# Altium project wulpus_pro_acq_pcb.PrjPcb (part 2 of 2)

## Sheet msp430.SchDoc: WULPUS PRO
size A3; DrawnBy: Sergei Vostrikov; Organization: Integrated Systems Laboratory; Revision: 1.0.0; SheetNumber: 6; SheetTotal: 8
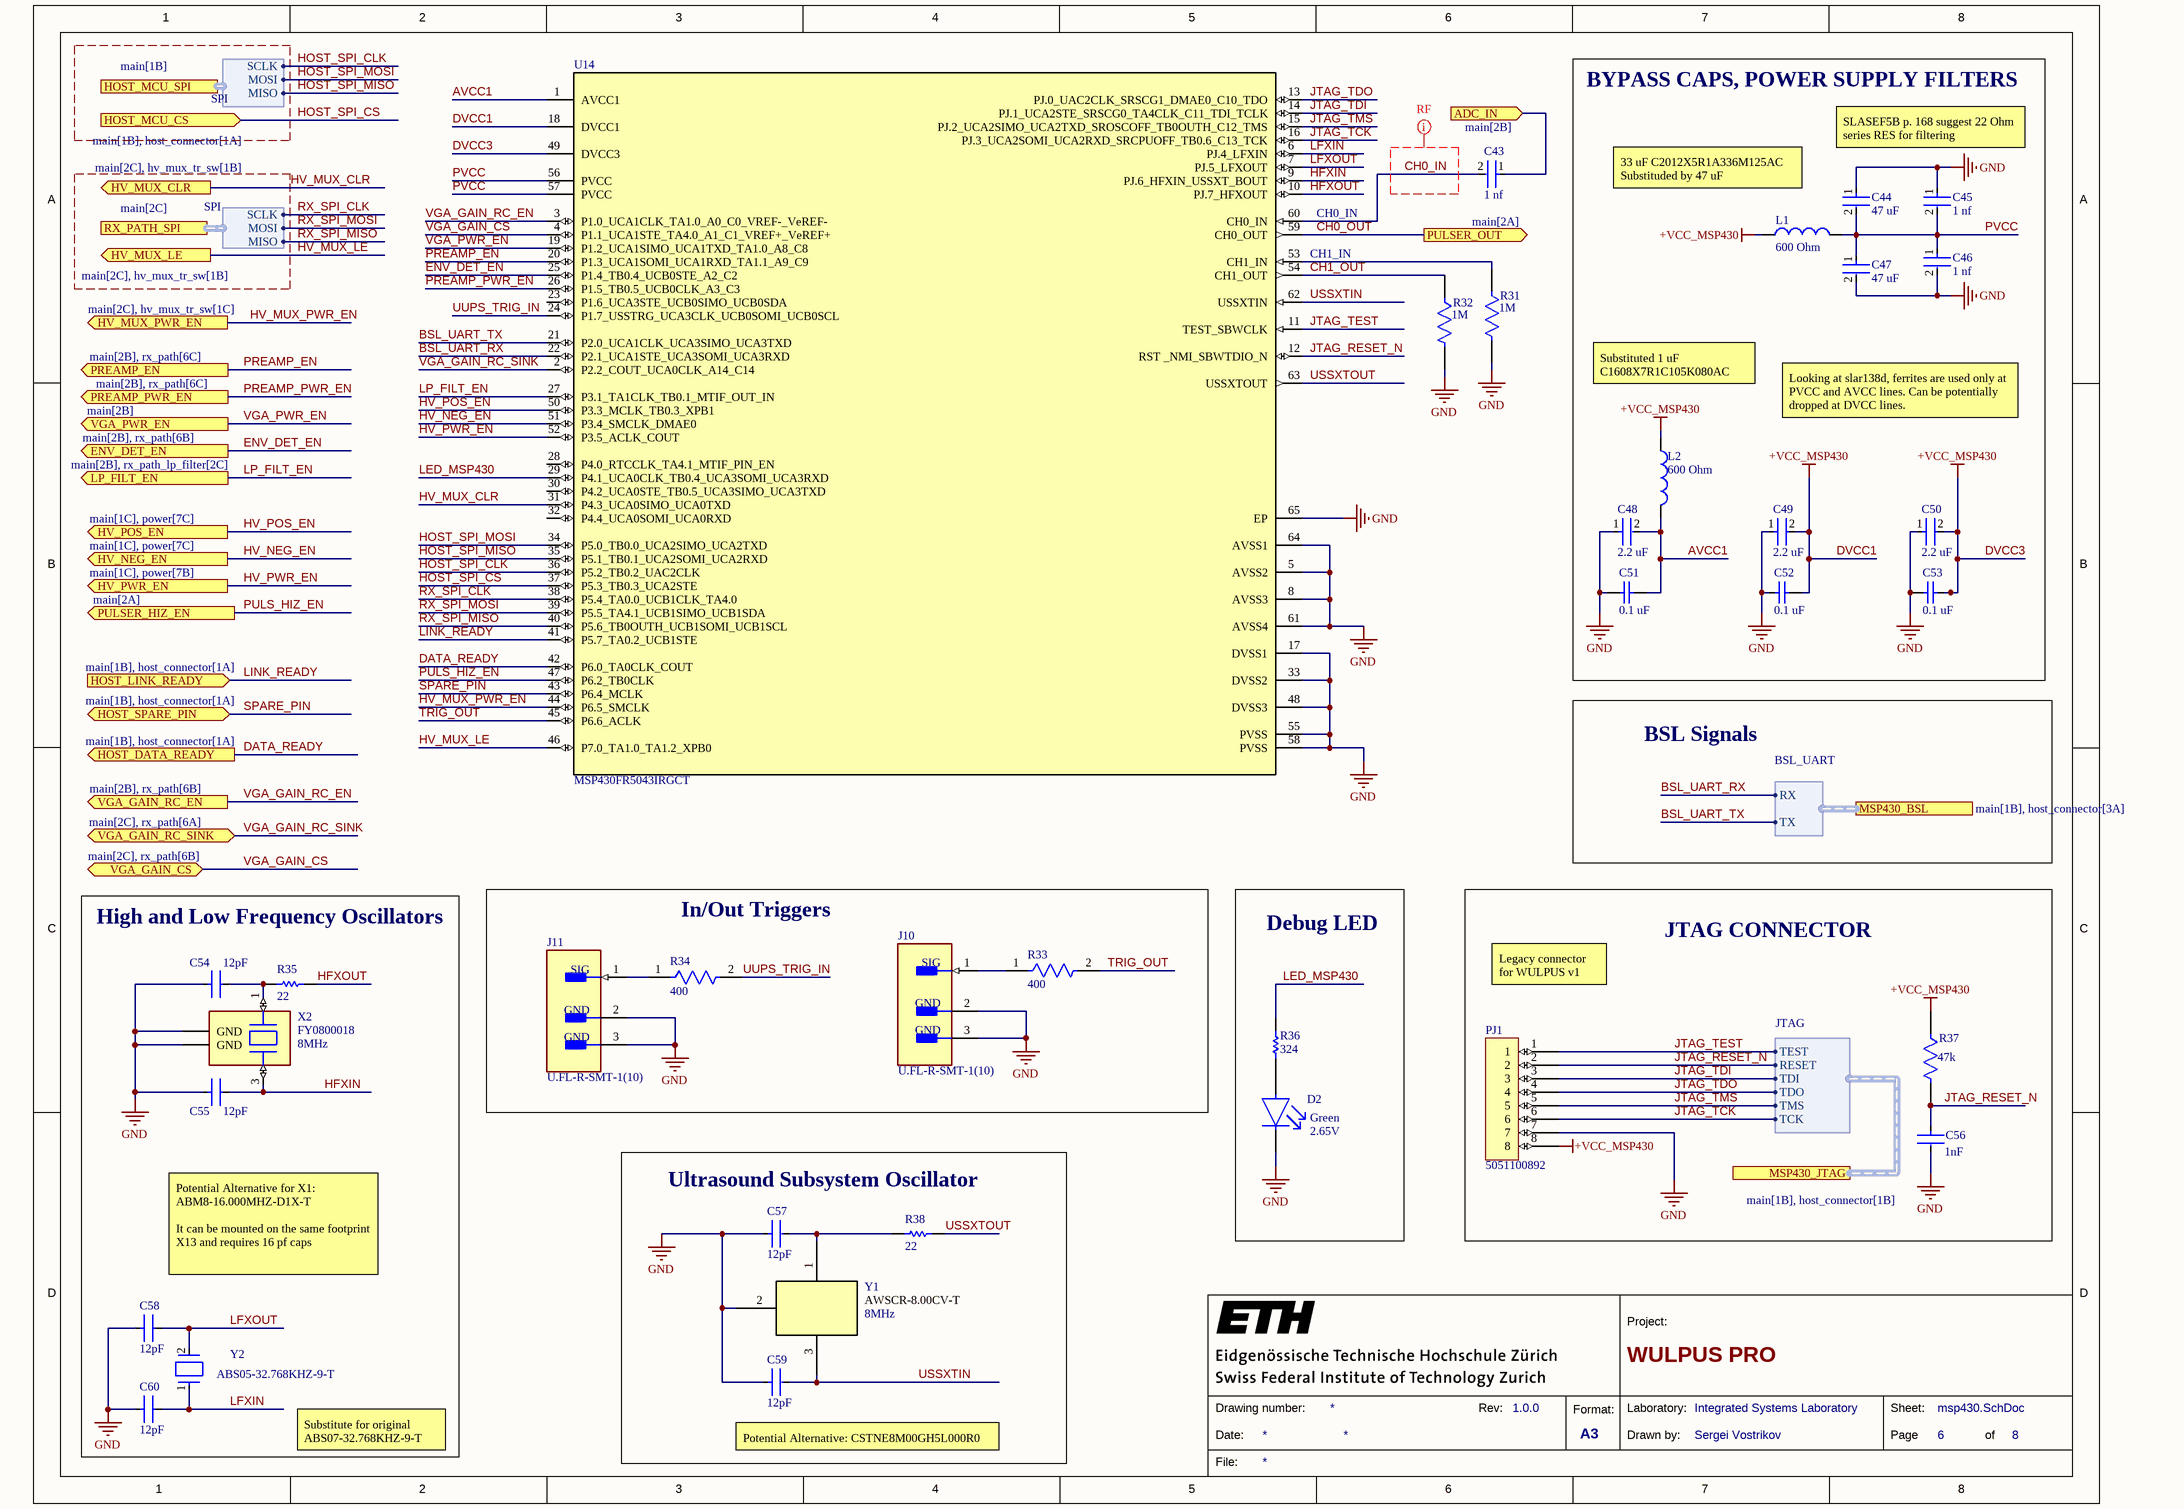
[diagram p5: msp430.SchDoc]

### Parts
C43  1 nf  [FP-GRM155-0_05-IPC_B]
C44  47 uF  [FP-GRM188-0_2-MFG]
C45  1 nf  [FP-GRM155-0_05-IPC_B]
C46  1 nf  [FP-GRM155-0_05-IPC_B]
C47  47 uF  [FP-GRM188-0_2-MFG]
C48  2.2 uF  [FP-C1005-050-0_15-0_1-MFG]
C49  2.2 uF  [FP-C1005-050-0_15-0_1-MFG]
C50  2.2 uF  [FP-C1005-050-0_15-0_1-MFG]
C51  0.1 uF  [CAPC1005X55X30LL05T10]
C52  0.1 uF  [CAPC1005X55X30LL05T10]
C53  0.1 uF  [CAPC1005X55X30LL05T10]
C54  Capacitance: 12pF  [FP-GJM155-0_05-IPC_A]  (hidden comment: GJM1555C1H120GB01D)
C55  Capacitance: 12pF  [FP-GJM155-0_05-IPC_A]  (hidden comment: GJM1555C1H120GB01D)
C56  Capacitance: 1nF  [FP-GRM155-0_05-IPC_B]  (hidden comment: GRM1555C1H102JA01D)
C57  Capacitance: 12pF  [FP-GJM155-0_05-IPC_A]  (hidden comment: GJM1555C1H120GB01D)
C58  Capacitance: 12pF  [FP-GJM155-0_05-IPC_A]  (hidden comment: GJM1555C1H120GB01D)
C59  Capacitance: 12pF  [FP-GJM155-0_05-IPC_A]  (hidden comment: GJM1555C1H120GB01D)
C60  Capacitance: 12pF  [FP-GJM155-0_05-IPC_A]  (hidden comment: GJM1555C1H120GB01D)
D2  Forward Voltage: 2.65V  Color: Green  [FP-APHD1608LZGCK-MFG]  (hidden comment: APHD1608LZGCK)
J10  U.FL-R-SMT-1(10)  [FP-U_FL-R-SMT-1_10-MFG]
J11  U.FL-R-SMT-1(10)  [FP-U_FL-R-SMT-1_10-MFG]
L1  Impedance: 600 Ohm  [SMD-0805]  (hidden comment: 742792040)
L2  Impedance: 600 Ohm  [SMD-0805]  (hidden comment: 742792040)
PJ1  5051100892  [MOLEX_5051100892]
R31  Resistance: 1M  [FP-CRCW0402-e3-MFG]  (hidden comment: CRCW04021M00FKED)
R32  Resistance: 1M  [FP-CRCW0402-e3-MFG]  (hidden comment: CRCW04021M00FKED)
R33  400  [FP-CRCW0402-C-e3-MFG]
R34  400  [FP-CRCW0402-C-e3-MFG]
R35  Resistance: 22  [RESC1005X40X25NL05T10]  (hidden comment: RC0402JR-0722RL)
R36  Resistance: 324  [RESC1005X35X20ML05T10]  (hidden comment: CPF0402B324RE1)
R37  Resistance: 47k  [FP-CRCW0402-e3-IPC_C]  (hidden comment: CRCW040247K0FKED)
R38  Resistance: 22  [RESC1005X40X25NL05T10]  (hidden comment: RC0402JR-0722RL)
U14  MSP430FR5043IRGCT  [RGC0064G]
X2  FY0800018  Frequency: 8MHz  [XTAL_ECS-80-18-30B-AGN-TR]
Y1  Frequency: 8MHz  [AWSCR-8.00CV-T_ABR]  (hidden comment: AWSCR-8.00CV-T)
Y2  ABS05-32.768KHZ-9-T  [FP-ABS05-MFG]

### Blocks framed on the sheet
BYPASS CAPS, POWER SUPPLY FILTERS: C44-C53 L1 L2
High and Low Frequency Oscillators: C54 C55 C58 C60 R35 X2 Y2
In/Out Triggers: J10 J11 R33 R34
Debug LED: D2 R36
JTAG CONNECTOR: C56 PJ1 R37
Ultrasound Subsystem Oscillator: C57 C59 R38 Y1

### Ports
ADC_IN (in, see main[2B]), ENV_DET_EN (out, see main[2B], rx_path[6B]), HOST_DATA_READY (out, see main[1B], host_connector[1A]), HOST_LINK_READY (in, see main[1B], host_connector[1A]), HOST_MCU_CS (in, see main[1B], host_connector[1A]), HOST_MCU_SPI (harness SPI, see main[1B]), HOST_SPARE_PIN (bidir, see main[1B], host_connector[1A]), HV_MUX_CLR (out, see main[2C], hv_mux_tr_sw[1B]), HV_MUX_LE (out, see main[2C], hv_mux_tr_sw[1B]), HV_MUX_PWR_EN (out, see main[2C], hv_mux_tr_sw[1C]), HV_NEG_EN (out, see main[1C], power[7C]), HV_POS_EN (out, see main[1C], power[7C]), HV_PWR_EN (out, see main[1C], power[7B]), LP_FILT_EN (out, see main[2B], rx_path_lp_filter[2C]), MSP430_BSL (harness BSL_UART, see main[1B], host_connector[3A]), MSP430_JTAG (harness JTAG, see main[1B], host_connector[1B]), PREAMP_EN (out, see main[2B], rx_path[6C]), PREAMP_PWR_EN (out, see main[2B], rx_path[6C]), PULSER_HIZ_EN (out, see main[2A]), PULSER_OUT (out, see main[2A]), RX_PATH_SPI (harness SPI, see main[2C]), VGA_GAIN_CS (bidir, see main[2C], rx_path[6B]), VGA_GAIN_RC_EN (out, see main[2B], rx_path[6B]), VGA_GAIN_RC_SINK (bidir, see main[2C], rx_path[6A]), VGA_PWR_EN (out, see main[2B])

### Harnesses
SPI: SCLK, MOSI, MISO
JTAG: TEST, RESET, TDI, TDO, TMS, TCK
BSL_UART: TX, RX

### Nets
DVCC1: C49.2 C50.2 C52.1 C53.1 L1.1 L2.1 PJ1.8 R37.1 U14.18(DVCC1) U14.49(DVCC3)  [also labelled +VCC_MSP430, DVCC3]
GND: C44.1 C45.1 C46.2 C47.2 C48.1 C49.1 C50.1 C51.2 C52.2 C53.2 C54.1 C55.1 C56.2 C57.1 C58.1 C59.1 C60.1 D2.1(C) J10.2(GND) J10.3(GND) J11.2(GND) J11.3(GND) PJ1.7 R31.2 R32.2 U14.5(AVSS2) U14.8(AVSS3) U14.17(DVSS1) U14.33(DVSS2) U14.48(DVSS3) U14.55(PVSS) U14.58(PVSS) U14.61(AVSS4) U14.64(AVSS1) U14.65(EP) X2.2(GND) X2.4(GND) Y1.2
AVCC1: C48.2 C51.1 L2.2 U14.1(AVCC1)
BSL_UART_RX: U14.22(P2.1_UCA1STE_UCA3SOMI_UCA3RXD) ; port MSP430_BSL.RX
BSL_UART_TX: U14.21(P2.0_UCA1CLK_UCA3SIMO_UCA3TXD) ; port MSP430_BSL.TX
CH0_IN: C43.2 U14.60(CH0_IN)
CH0_OUT: U14.59(CH0_OUT) ; port PULSER_OUT
CH1_OUT: R32.1 U14.54(CH1_OUT)
DATA_READY: U14.42(P6.0_TA0CLK_COUT) ; port HOST_DATA_READY
ENV_DET_EN: U14.25(P1.4_TB0.4_UCB0STE_A2_C2) ; port ENV_DET_EN
HFXIN: C55.2 U14.9(PJ.6_HFXIN_USSXT_BOUT) X2.3(OUT/IN)
HFXOUT: R35.2 U14.10(PJ.7_HFXOUT)
HOST_SPI_CLK: U14.36(P5.2_TB0.2_UAC2CLK) ; port HOST_MCU_SPI.SCLK
HOST_SPI_CS: U14.37(P5.3_TB0.3_UCA2STE) ; port HOST_MCU_CS
HOST_SPI_MISO: U14.35(P5.1_TB0.1_UCA2SOMI_UCA2RXD) ; port HOST_MCU_SPI.MISO
HOST_SPI_MOSI: U14.34(P5.0_TB0.0_UCA2SIMO_UCA2TXD) ; port HOST_MCU_SPI.MOSI
HV_MUX_CLR: U14.31(P4.3_UCA0SIMO_UCA0TXD) ; port HV_MUX_CLR
HV_MUX_LE: U14.46(P7.0_TA1.0_TA1.2_XPB0) ; port HV_MUX_LE
HV_MUX_PWR_EN: U14.44(P6.5_SMCLK) ; port HV_MUX_PWR_EN
HV_NEG_EN: U14.51(P3.4_SMCLK_DMAE0) ; port HV_NEG_EN  [project net HV_EN2]
HV_POS_EN: U14.50(P3.3_MCLK_TB0.3_XPB1) ; port HV_POS_EN  [project net HV_EN1]
HV_PWR_EN: U14.52(P3.5_ACLK_COUT) ; port HV_PWR_EN
JTAG_RESET_N: C56.1 PJ1.2 R37.2 U14.12(RST__NMI_SBWTDIO_N) ; port MSP430_JTAG.RESET
JTAG_TCK: PJ1.6 U14.16(PJ.3_UCA2SOMI_UCA2RXD_SRCPUOFF_TB0.6_C13_TCK) ; port MSP430_JTAG.TCK
JTAG_TDI: PJ1.3 U14.14(PJ.1_UCA2STE_SRSCG0_TA4CLK_C11_TDI_TCLK) ; port MSP430_JTAG.TDI
JTAG_TDO: PJ1.4 U14.13(PJ.0_UAC2CLK_SRSCG1_DMAE0_C10_TDO) ; port MSP430_JTAG.TDO
JTAG_TEST: PJ1.1 U14.11(TEST_SBWCLK) ; port MSP430_JTAG.TEST
JTAG_TMS: PJ1.5 U14.15(PJ.2_UCA2SIMO_UCA2TXD_SROSCOFF_TB0OUTH_C12_TMS) ; port MSP430_JTAG.TMS
LED_MSP430: R36.1 U14.29(P4.1_UCA0CLK_TB0.4_UCA3SOMI_UCA3RXD)
LFXIN: C60.2 U14.6(PJ.4_LFXIN) Y2.1
LFXOUT: C58.2 U14.7(PJ.5_LFXOUT) Y2.2
LINK_READY: U14.41(P5.7_TA0.2_UCB1STE) ; port HOST_LINK_READY  [project net HOST_LINK_RDY]
LP_FILT_EN: U14.27(P3.1_TA1CLK_TB0.1_MTIF_OUT_IN) ; port LP_FILT_EN  [project net FILTER_SHDN_N]
PREAMP_EN: U14.20(P1.3_UCA1SOMI_UCA1RXD_TA1.1_A9_C9) ; port PREAMP_EN
PREAMP_PWR_EN: U14.26(P1.5_TB0.5_UCB0CLK_A3_C3) ; port PREAMP_PWR_EN
PULS_HIZ_EN: U14.47(P6.2_TB0CLK) ; port PULSER_HIZ_EN
PVCC: C44.2 C45.2 C46.1 C47.1 L1.2 U14.56(PVCC) U14.57(PVCC)
RX_SPI_CLK: U14.38(P5.4_TA0.0_UCB1CLK_TA4.0) ; port RX_PATH_SPI.SCLK
RX_SPI_MISO: U14.40(P5.6_TB0OUTH_UCB1SOMI_UCB1SCL) ; port RX_PATH_SPI.MISO
RX_SPI_MOSI: U14.39(P5.5_TA4.1_UCB1SIMO_UCB1SDA) ; port RX_PATH_SPI.MOSI
SPARE_PIN: U14.43(P6.4_MCLK) ; port HOST_SPARE_PIN  [project net HOST_SPARE]
TRIG_OUT: R33.2 U14.45(P6.6_ACLK)
USSXTIN: C59.2 U14.62(USSXTIN) Y1.3
USSXTOUT: R38.2 U14.63(USSXTOUT)
UUPS_TRIG_IN: R34.2 U14.24(P1.7_USSTRG_UCA3CLK_UCB0SOMI_UCB0SCL)
VGA_GAIN_CS: U14.4(P1.1_UCA1STE_TA4.0_A1_C1_VREF+_VeREF+) ; port VGA_GAIN_CS
VGA_GAIN_RC_EN: U14.3(P1.0_UCA1CLK_TA1.0_A0_C0_VREF-_VeREF-) ; port VGA_GAIN_RC_EN
VGA_GAIN_RC_SINK: U14.2(P2.2_COUT_UCA0CLK_A14_C14) ; port VGA_GAIN_RC_SINK
VGA_PWR_EN: U14.19(P1.2_UCA1SIMO_UCA1TXD_TA1.0_A8_C8) ; port VGA_PWR_EN
NetC27_2: C43.1 ; port ADC_IN
NetC54_2: C54.2 R35.1 X2.1(IN/OUT)
NetC57_2: C57.2 R38.1 Y1.1
NetD2_2: D2.2(A) R36.2
NetJ10_1: J10.1(SIG) R33.1
NetJ11_1: J11.1(SIG) R34.1
NetR31_1: R31.1 U14.53(CH1_IN)

Not connected (* = marked no-connect by the designer): U14 23(P1.6_UCA3STE_UCB0SIMO_UCB0SDA) 28(P4.0_RTCCLK_TA4.1_MTIF_PIN_EN) 30(P4.2_UCA0STE_TB0.5_UCA3SIMO_UCA3TXD) 32(P4.4_UCA0SOMI_UCA0RXD)

### Layout directives
net class RF: CH0_IN

### Notes on the sheet
- 33 uF C2012X5R1A336M125AC Substituded by 47 uF
- SLASEF5B p. 168 suggest 22 Ohm series RES for filtering
- (near U14) CH0_IN
- (near U14) CH1_IN
- Substituted 1 uF C1608X7R1C105K080AC
- Looking at slar138d, ferrites are used only at PVCC and AVCC lines. Can be potentially dropped at DVCC lines.
- BSL Signals
- Legacy connector for WULPUS v1
- Potential Alternative for X1:
  ABM8-16.000MHZ-D1X-T
  It can be mounted on the same footprint X13 and requires 16 pf caps
- Substitute for original ABS07-32.768KHZ-9-T
- (near C59) Potential Alternative: CSTNE8M00GH5L000R0
- 1
- 2
- 3
- 4
- 5
- 6
- 7
- 8
- A
- B
- C
- D
- Project:
- Date:
- Drawing number:
- Rev:
- Format:
- A3
- Drawn by:
- Laboratory:
- Page
- Sheet:
- of
- File:

### Library data of the parts
C43 C45 C46 = CMP-2008-04254-2: GRM1555C1H102JA01D; Tolerance: 5%; Temperature Coefficient: 30ppm/°C; Insulation Resistance: 10GR; Material: Ceramic; Voltage Rating: 50V; Dielectric: C0G; Capacitance: 1nF; Packaging: Tape and Reel; Lead Free: Lead Free; Thickness: 0.022inch; Termination: SMD/SMT; Max Operating Temperature: 125°C; Height: 0.5mm; Package Quantity: 1; Radiation Hardening: No; Case Code (Metric): 1005; Number of Pins: 2; Mount: Surface Mount; Voltage: 50V; Case/Package: 0402; Min Operating Temperature: -55°C; Dielectric Material: Ceramic; Width: 0.5mm; Depth: 0.5mm; Case Code (Imperial): 0402; REACH SVHC: No SVHC; Voltage Rating (DC): 50V; Length: 1mm
C44 C47 = CMP-00260-117335223-1: GRM188R60J476ME01D; Material: Ceramic; Tolerance: 20%; Voltage Rating (DC): 6.3V; Dielectric: X5R; Capacitance: 47µF; Case/Package: 0603; Width: 800µm; Min Operating Temperature: -55°C; Lifecycle Status: Production; Height: 1mm; Length: 1.6mm; Max Operating Temperature: 85°C; Voltage Rating: 6.3V; NexarPartId: 117335223; Thickness: 800µm
C48-C50 = CMP-08246-004344-1: C1005X7S1A225K050BC; Capacitance: 2.2uF; Dielectric: X7S; Dielectric Material: Ceramic; Voltage Rating: 10V; Tolerance: 10%; Mount: Surface Mount; Height: 0.5mm; Package Quantity: 1; Depth: 0.5mm; RoHS Compliant: Yes; Length: 1mm; Thickness: 0.022inch; Packaging: Tape and Reel; Case Code (Imperial): 0402; Resistor Type: Ceramic; Case/Package: 0402; Min Operating Temperature: -55°C; Series: C; Weight: 2.3E-05oz; Width: 0.02inch; Voltage Rating (DC): 10V; Case Code (Metric): 1005; Max Operating Temperature: 125°C; Termination: SMD/SMT; Lead Free: Lead Free
C51-C53 = CMP-0001-00074-2: C0402C104K4RACTU; Manufacturer: Kemet; Part Number: C0402C104K4RACTU
C54 C55 C57-C60 = CMP-2008-03799-2: Multi-Layer Ceramic Capacitor 12pF C0G  ±2% 0402 Paper T/R; Voltage Rating: 50V; Tolerance: 2%; Length: 1mm; Width: 0.5mm; Thickness: 0.022inch; Package Quantity: 10000; Lead Free: Lead Free; Mount: Surface Mount; Voltage Rating (DC): 50V; Max Operating Temperature: 125°C; Termination: SMD/SMT; Depth: 0.5mm; Min Operating Temperature: -55°C; Height: 0.5mm; Case Code (Imperial): 0402; Case/Package: 0402; Case Code (Metric): 1005; Dielectric: C0G; Packaging: Tape and Reel; Radiation Hardening: No
C56 = CMP-2008-04254-2: Chip Multilayer Ceramic Capacitors for General Purpose, 0402, 1000pF, C0G, 30ppm/°C, 5%, 50V; Insulation Resistance: 10GR; Packaging: Tape and Reel; Lead Free: Lead Free; Tolerance: 5%; Temperature Coefficient: 30ppm/°C; Thickness: 0.022inch; Termination: SMD/SMT; Max Operating Temperature: 125°C; Height: 0.5mm; Package Quantity: 1; Radiation Hardening: No; Material: Ceramic; Case Code (Metric): 1005; Number of Pins: 2; Voltage Rating: 50V; Mount: Surface Mount; Voltage: 50V; Case/Package: 0402; Min Operating Temperature: -55°C; Dielectric Material: Ceramic; Width: 0.5mm; Depth: 0.5mm; Case Code (Imperial): 0402; REACH SVHC: No SVHC; Dielectric: C0G; Voltage Rating (DC): 50V; Length: 1mm
D2 = CMP-44529-000045-1: LED GREEN CLEAR 1608 SMD; Test Current: 2mA; Dominant Wavelength: 525nm; Lens Color: Colorless; Luminous Intensity: 180mcd; Viewing Angle: 100°; Lens Size: 0.7mm; Lens Style: Round; Mount: Surface Mount; Packaging: Tape and Reel; Lens Transparency: Clear; Height: 0.75mm; Case/Package: 0603; Length: 1.6mm; Case Code (Metric): 1608; Width: 0.8mm; Case Code (Imperial): 0603
J10 J11 = CMP-2000-05152-3: CONN U.FL RCPT STR 50 OHM SMD; Max Frequency: 6GHz; Connector Type: Coaxial; Body Plating: Silver; Body Material: Bronze; Impedance: 50R; Dielectric Material: Polymer; Insulation Resistance: 500MR; Gender: Male; Packaging: Cut Tape; Length: 3mm; Package Quantity: 2500; Termination: Solder; Lead Free: Lead Free; Series: U.FL; Min Operating Temperature: -40°C; Fastening Type: Snap; Contact Material: Brass; Orientation: Straight; Wire/Cable Type: Coaxial; Frequency: 6GHz; Contact Plating: Gold; Depth: 3.1mm; Weight: 0.001764oz; Max Operating Temperature: 90°C; Radiation Hardening: No; REACH SVHC: No SVHC; Mount: Surface Mount; Housing Color: Beige
L1 L2 = CMP-0220-00032-1: SMD EMI Suppression Ferrite Bead WE-CBF, Z = 600 Ohm; PackageVersion: 2005; ComponentLink2Description: Datasheet; PackageDescription: Chip Inductor, 2-Leads, Body 2.0 x 1.2 mm; ComponentLink1URL: http://www.we-online.com; PackageReference: SMD-0805; DatasheetVersion: Dec-2005; ComponentLink2URL: http://www.we-online.de/katalog/media/pdf/742792040.pdf; ComponentLink1Description: Manufacturer Link
PJ1 = MOLEX_5051100892
R31 R32 = CMP-2002-08314-2: RES Thick Film, 1MΩ, 1%, 0.063W, 100ppm/°C, 0402; Power Rating: 63mW; Voltage Rating (DC): 50V; Min Operating Temperature: -55°C; Lead Free: Lead Free; Case Code (Imperial): 0402; Packaging: Tape and Reel; Case Code (Metric): 1005; Tolerance: 1%; Number of Terminations: 2; Features: Automotive AEC-Q200; Number of Pins: 2; Max Power Dissipation: 63mW; Height: 0.35mm; Weight: 2.3E-05oz; Package Quantity: 10; Contact Plating: Tin; Temperature Coefficient: 100ppm/°C; Radiation Hardening: No; Length: 1mm; Termination: SMD/SMT; Depth: 0.5mm; Case/Package: 0402; Voltage Rating: 50V; Composition: Thick Film; Width: 0.02inch; Max Operating Temperature: 155°C; Military Standard: Not
R33 R34 = CMP-00030-23798141-1: CRCW04021R00FKEDC; Resistance: 1Ω; Tolerance: 1%; Temperature Coefficient: 100ppm/°C; Voltage Rating: 50V; Power Rating: 63mW; Lead Free: Lead Free; Case/Package: 0402; Max Operating Temperature: 155°C; RoHS: Compliant; Height: 350µm; Schedule B: 8533210045, 8533210045; Composition: Thick Film; NexarPartId: 23798141; Min Operating Temperature: -55°C
R35 R38 = CMP-2002-07961-1: Manufacturer: Yageo / Phycomp; Part Number: RC0402JR-0722RL
R36 = CMP-2002-03257-1: Manufacturer: TE Connectivity / AMP; Part Number: CPF0402B324RE1
R37 = CMP-02407-007705-1: RES Thick Film, 47kΩ, 1%, 0.063W, 100ppm/°C, 0402; Voltage Rating (DC): 50V; Power Rating: 63mW; Temperature Coefficient: 100ppm/°C; Mount: Surface Mount; Radiation Hardening: No; Case Code (Imperial): 0402; Case Code (Metric): 1005; Contact Plating: Tin; Case/Package: 0402; Package Quantity: 10000; Width: 0.5mm; Lead Free: Lead Free; Packaging: Tape and Reel; Length: 1mm; Max Operating Temperature: 155°C; Min Operating Temperature: -55°C; Tolerance: 1%; Weight: 2.3E-05oz; Working Voltage: 50V; Voltage Rating: 50V; Height: 0.35mm; Depth: 0.5mm; Composition: Thick Film; Number of Terminations: 2; Termination: SMD/SMT; Military Standard: Not
U14 = MSP430FR5043IRGCT: No Description Available; Mfr_Name: Texas Instruments; Type: DEV; RefDes: RefDes; Copyright: Copyright (C) 2021 Ultra Librarian. All rights reserved.; Manufacturer_Part_Number: MSP430FR5043IRGCT
X2 = FY0800018: Crystal 8MHz ±30ppm (Tol) ±30ppm (Stability) 18pF FUND 100Ohm 4-Pin SMD T/R; Manufacturer: Diodes; ESR (Equivalent Series Resistance): 100R; Supplier 1: Digi-Key; Manufacturer Part Number: FY0800018; RoHS: Yes; Category: Crystals; Stock 1: 10869; Pricing 1: 1=0.80000, 10=0.70800, 50=0.66220, 100=0.58520, 500=0.55440 (USD); Mount: Surface Mount; Case/Package: SMD/SMT; Min Operating Temperature: -40°C; Max Operating Temperature: 85°C; Packaging: Cut Tape; Frequency Stability: 30ppm; Frequency Tolerance: 30ppm; Load Capacitance: 18pF; Length: 0.197inch; Width: 0.126inch; Height: 0.043inch; ComponentLink1URL: http://media.digikey.com/pdf/Data%20Sheets/Pericom%20PDFs/FY0800018_VerB.pdf?src-supplier=Digi-Key; ComponentLink1Description: http://media.digikey.com/pdf/Data%20Sheets/Pericom%20PDFs/FY0800018_VerB.pdf?src-supplier=Digi-Key; Supplier Part Number 1: FY0800018CT-ND
Y1 = AWSCR-8.00CV-T: No Description Available; Mfr_Name: Abracon; Copyright: Copyright (C) 2021 Ultra Librarian. All rights reserved.; RefDes: RefDes; Type: DEV; Manufacturer_Part_Number: AWSCR-8.00CV-T
Y2 = CMP-27762-000002-3: CRYSTAL 32.7680KHZ 9PF SMD; Tolerance: 20ppm; Series Resistance: 90kR; Series: ABS05; Frequency: 32.768kHz; Radiation Hardening: No; Min Operating Temperature: -40°C; RoHS Compliant: Yes; Termination: SMD/SMT; Max Operating Temperature: 85°C; Depth: 1mm; Load Capacitance: 9pF; Number of Pins: 2; Frequency Tolerance: 20ppm; Package Quantity: 3000; Operating Frequency: 32.768 kHz; Case/Package: CSMD; Height: 0.5mm; Length: 1.6mm; REACH SVHC: No SVHC; Packaging: Tape and Reel; ESR (Equivalent Series Resistance): 90kR; Mount: Surface Mount; Lead Free: Lead Free; Width: 1mm

## Sheet host_connector.SchDoc: WULPUS PRO
size A4; DrawnBy: Sergei Vostrikov; Organization: Integrated Systems Laboratory; Revision: 1.0.0; SheetNumber: 8; SheetTotal: 8
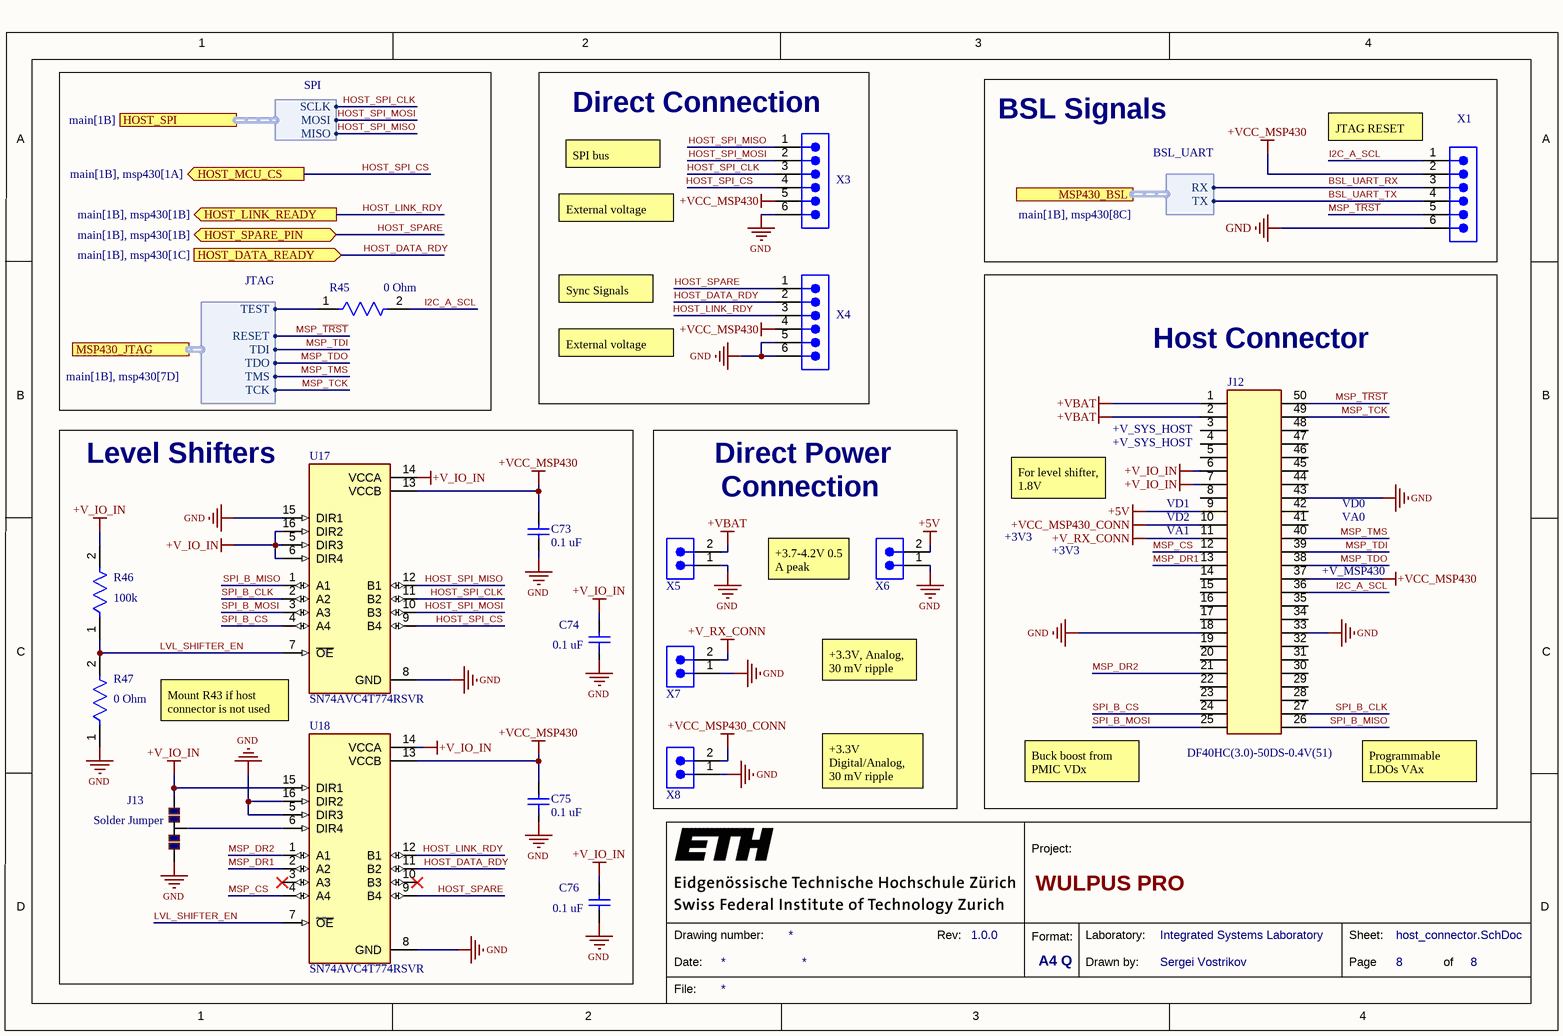
[diagram p6: host_connector.SchDoc]

### Parts
C73  0.1 uF  [CAPC1005X55X30LL05T10]
C74  0.1 uF  [CAPC1005X55X30LL05T10]
C75  0.1 uF  [CAPC1005X55X30LL05T10]
C76  0.1 uF  [CAPC1005X55X30LL05T10]
J12  DF40HC(3.0)-50DS-0.4V(51)  [DF40HC3050DS04V51]
J13  Solder Jumper  [Jumper 3 pins]  (no BOM)
R45  0 Ohm  [FP-CRCW0402-e3-IPC_C]
R46  100k  [FP-ERJ2RK-IPC_C]
R47  0 Ohm  [FP-CRCW0402-e3-IPC_C]
U17  SN74AVC4T774RSVR  [QFN40P260X180X55-16N]
U18  SN74AVC4T774RSVR  [QFN40P260X180X55-16N]
X1  68000-106HLF  [68000-106HLF]  (value not drawn)
X3  68000-106HLF  [68000-106HLF]  (value not drawn)
X4  68000-106HLF  [68000-106HLF]  (value not drawn)
X5  68000-102HLF  [68000-102HLF]  (value not drawn)
X6  68000-102HLF  [68000-102HLF]  (value not drawn)
X7  68000-102HLF  [68000-102HLF]  (value not drawn)
X8  68000-102HLF  [68000-102HLF]  (value not drawn)

### Blocks framed on the sheet
Direct Connection: X3 X4
BSL Signals: X1
Host Connector: J12
Level Shifters: C73-C76 J13 R46 R47 U17 U18

### Ports
HOST_DATA_READY (in, see main[1B], msp430[1C]), HOST_LINK_READY (out, see main[1B], msp430[1B]), HOST_MCU_CS (out, see main[1B], msp430[1A]), HOST_SPARE_PIN (bidir, see main[1B], msp430[1B]), HOST_SPI (harness SPI, see main[1B]), MSP430_BSL (harness BSL_UART, see main[1B], msp430[8C]), MSP430_JTAG (harness JTAG, see main[1B], msp430[7D])

### Harnesses
SPI: SCLK, MOSI, MISO
JTAG: TEST, RESET, TDI, TDO, TMS, TCK
BSL_UART: TX, RX

### Nets
+5V: J12.9 X6.2
+V_IO_IN: C74.1 C76.1 J12.6 J12.7 J13.3 R46.2 U17.5(DIR3) U17.6(DIR4) U17.14(VCCA) U17.16(DIR2) U18.14(VCCA) U18.15(DIR1)
+V_RX_CONN: J12.11 X7.2
+VBAT: J12.1 J12.2 X5.2
+VCC_MSP430: C73.1 C75.1 J12.37 U17.13(VCCB) U18.13(VCCB) X1.2 X3.5 X4.4  [project net DVCC1]
+VCC_MSP430_CONN: J12.10 X8.2
GND: C73.2 C74.2 C75.2 C76.2 J12.18 J12.33 J12.43 J13.1 R47.1 U17.8(GND) U17.15(DIR1) U18.5(DIR3) U18.8(GND) U18.16(DIR2) X1.6 X3.6 X4.5 X4.6 X5.1 X6.1 X7.1 X8.1
BSL_UART_RX: X1.3 ; port MSP430_BSL.RX
BSL_UART_TX: X1.4 ; port MSP430_BSL.TX
HOST_DATA_RDY: U18.11(B2) X4.2 ; port HOST_DATA_READY  [project net DATA_READY]
HOST_LINK_RDY: U18.12(B1) X4.3 ; port HOST_LINK_READY
HOST_SPARE: U18.9(B4) X4.1 ; port HOST_SPARE_PIN
HOST_SPI_CLK: U17.11(B2) X3.3 ; port HOST_SPI.SCLK
HOST_SPI_CS: U17.9(B4) X3.4 ; port HOST_MCU_CS
HOST_SPI_MISO: U17.12(B1) X3.1 ; port HOST_SPI.MISO
HOST_SPI_MOSI: U17.10(B3) X3.2 ; port HOST_SPI.MOSI
I2C_A_SCL: J12.36 R45.2 X1.1
JTAG_TEST: R45.1 ; port MSP430_JTAG.TEST
LVL_SHIFTER_EN: R46.1 R47.2 U17.7(~{OE}) U18.7(~{OE})
MSP_CS: J12.12 U18.4(A4)
MSP_DR1: J12.13 U18.2(A2)
MSP_DR2: J12.21 U18.1(A1)
MSP_~{TRST}: J12.50 X1.5 ; port MSP430_JTAG.RESET  [project net JTAG_RESET_N]
MSP_TCK: J12.49 ; port MSP430_JTAG.TCK  [project net JTAG_TCK]
MSP_TDI: J12.39 ; port MSP430_JTAG.TDI  [project net JTAG_TDI]
MSP_TDO: J12.38 ; port MSP430_JTAG.TDO  [project net JTAG_TDO]
MSP_TMS: J12.40 ; port MSP430_JTAG.TMS  [project net JTAG_TMS]
SPI_B_CLK: J12.27 U17.2(A2)
SPI_B_CS: J12.24 U17.4(A4)
SPI_B_MISO: J12.26 U17.1(A1)
SPI_B_MOSI: J12.25 U17.3(A3)
NetJ13_2: J13.2 U18.6(DIR4)

Not connected (* = marked no-connect by the designer): J12 3 4 5 8 14 15 16 17 19 20 22 23 28 29 30 31 32 34 35 41 42 44 45 46 47 48; U18 3(A3)* 10(B3)*

### Notes on the sheet
- SPI bus
- (near X1) JTAG RESET
- External voltage level
- Sync Signals
- (near J12) +V_SYS_HOST
- Direct Power
- Connection
- For level shifter, 1.8V
- (near J12) VD1
- (near J12) VD2
- VD0
- VA0
- +3.7-4.2V 0.5 A peak
- +3V3
- (near J12) VA1
- (near J12) +V_MSP430
- Mount R43 if host connector is not used
- +3.3V, Analog, 30 mV ripple
- +3.3V Digital/Analog, 30 mV ripple
- Buck boost from PMIC VDx
- Programmable LDOs VAx
- 1
- 2
- 3
- 4
- A
- B
- C
- Project:
- D
- Date:
- Drawing number:
- Rev:
- Format:
- A4 Q
- Drawn by:
- Laboratory:
- Page
- Sheet:
- of
- File:

### Library data of the parts
C73-C76 = CMP-0001-00074-2: C0402C104K4RACTU; Manufacturer: Kemet; Part Number: C0402C104K4RACTU
J12 = DF40HC(3.0)-50DS-0.4V(51): 50 Position 0.4mm Pitch Dual Row Vertical Surface Mount (SMT) Pin Socket, 3.0mm Stacking Height; Mfr_Name: Hirose; Copyright: Copyright (C) 2023 Ultra Librarian. All rights reserved.; Manufacturer_Part_Number: DF40HC(3.0)-50DS-0.4V(51); RefDes: RefDes; Type: DEV
J13 = CMP-00467-6: Solder Jumper 3 Pads; Technology: SMT
R45 R47 = CMP-2002-08122-2: CRCW04020000Z0ED; Tolerance: 5%; Max Power Dissipation: 63mW; Voltage Rating: 50V; Temperature Coefficient: 100ppm/°C; Resistance: 0mR; Contact Plating: Tin; Height: 0.35mm; Radiation Hardening: No; Features: Automotive AEC-Q200; Composition: Thick Film; Width: 0.5mm; Weight: 2.3E-05oz; Termination: SMD/SMT; Packaging: Tape and Reel; Mount: Surface Mount; Case Code (Metric): 1005; Military Standard: Not; Min Operating Temperature: -55°C; Number of Terminations: 2; Package Quantity: 1; Case Code (Imperial): 0402; Depth: 0.5mm; Max Operating Temperature: 155°C; Case/Package: 0402; Power Rating: 63mW; Lead Free: Lead Free; Voltage Rating (DC): 50V; Length: 1mm
R46 = CMP-2002-00608-4: ERJ-2RKF1003X; Resistance: 100kR; Voltage Rating (DC): 50V; Tolerance: 1%; Power Rating: 100mW; Temperature Coefficient: 100ppm/°C; Case/Package: 0402; Length: 1mm; Package Quantity: 1; Radiation Hardening: No; Case Code (Metric): 1005; Contact Plating: Tin; Mount: Surface Mount; Depth: 0.5mm; Max Operating Temperature: 155°C; Lead Free: Lead Free; Width: 0.5mm; Composition: Thick Film; Case Code (Imperial): 0402; Termination: SMD/SMT; Number of Pins: 2; Height: 0.35mm; Voltage Rating: 50V; Military Standard: Not; REACH SVHC: No SVHC; Packaging: Tape and Reel; Min Operating Temperature: -55°C; Max Power Dissipation: 100mW; Features: Automotive AEC-Q200; Number of Terminations: 2
U17 U18 = SN74AVC4T774RSVR: Voltage Level Translator Bidirectional 1 Circuit 4 Channel 380Mbps 16-UQFN _2.6x1.8_; MF: Texas Instruments; MP: SN74AVC4T774RSVR; DigiKey-Purchase-URL: https://snapeda.com/shop?store=DigiKey&id=192411; SnapEDA_Link: https://www.snapeda.com/parts/SN74AVC4T774RSVR/Texas%20Instruments/view-part/192411/?ref=snap; Digi-Key_Part_Number: 296-24741-1-ND; Package: UQFN-16 Texas Instruments; Value: *
X1 X3 X4 = CMP-00729-1: 6 Positions Header, Unshrouded Connector 0.100" (2.54mm) Through Hole Gold or Gold, GXT™; Current Rating: 3A; Voltage Rating: 1.5kV; Number of Positions: 6; Insulation Resistance: 5GR; Gender: Male; Connector Type: Male Pin; Mating Post Length: 5.84mm; Mount: Through Hole; Contact Plating: Nickel, Gold, GXT; Contact Material: Bronze; Colour: Black; Housing Colour: Black; Housing Material: Thermoplastic; Min Operating Temperature: -65°C; Max Operating Temperature: 125°C; Contact Gender: Male; Package Quantity: 100; Number of Rows: 1; Packaging: Bulk; Termination: Solder; Max Voltage Rating (AC): 1.5kV; Number of Contacts: 6; Orientation: Straight; Length: 15.24mm; Pitch: 2.54mm; Termination Post Length: 2.41mm; Contact Mating Length: 0.23inch; Depth: 2.41mm; Radiation Hardening: No; REACH SVHC: No SVHC; Flammability Rating: UL94 V-0
X5-X8 = CMP-00100-3: 2 Positions Header, Unshrouded Connector 0.100" (2.54mm) Through Hole Gold or Gold, GXT™; Manufacturer: Amphenol FCI; Number of Positions: 2; Connector Type: Male Pin; Current Rating: 3A; Gender: Male; Insulation Resistance: 5GR; Mating Post Length: 5.84mm; Max Voltage Rating (AC): 1.5kV; Packaging: Bulk; Supplier: Digikey; Supplier Part Number: 609-3500-ND; ComponentLink1Description: 68000-274228-5149165.pdf; ComponentLink1URL: https://datasheet.ciiva.com/5149/68000-274228-5149165.pdf; Pitch: 2.54mm; Manufacturer Part Number: 68000-102HLF; Number of Rows: 1; Termination: Solder; Contact Mating Length: 0.23inch; Case/Package: 100; Colour: Black; ComponentLink2Description: 68000-722084.pdf; ComponentLink2URL: https://datasheet.ciiva.com/722/68000-722084.pdf; ComponentLink3Description: 68000-10149324.pdf; ComponentLink3URL: https://datasheet.ciiva.com/10149/68000-10149324.pdf; ComponentLink4Description: 68000-16726309.pdf; ComponentLink4URL: https://datasheet.ciiva.com/16726/68000-16726309.pdf; Contact Gender: Male; Contact Material: Bronze; Contact Plating: Nickel,Gold,GXT; Depth: 2.41mm; Flammability Rating: UL94 V-0; Housing Colour: Black; Housing Material: Thermoplastic; Lead Free: Lead Free; Length: 5.08mm; Max Operating Temperature: 125°C; Min Operating Temperature: -65°C; Number of Contacts: 2; Orientation: Straight; Package Quantity: 100; Radiation Hardening: No; Termination Post Length: 2.41mm; Voltage Rating: 1.5kV; Voltage Rating (DC): 1.5kV

## Sheet power.SchDoc: WULPUS PRO
size A3; DrawnBy: Sergei Vostrikov; Organization: Integrated Systems Laboratory; Revision: 1.0.0; SheetNumber: 7; SheetTotal: 8
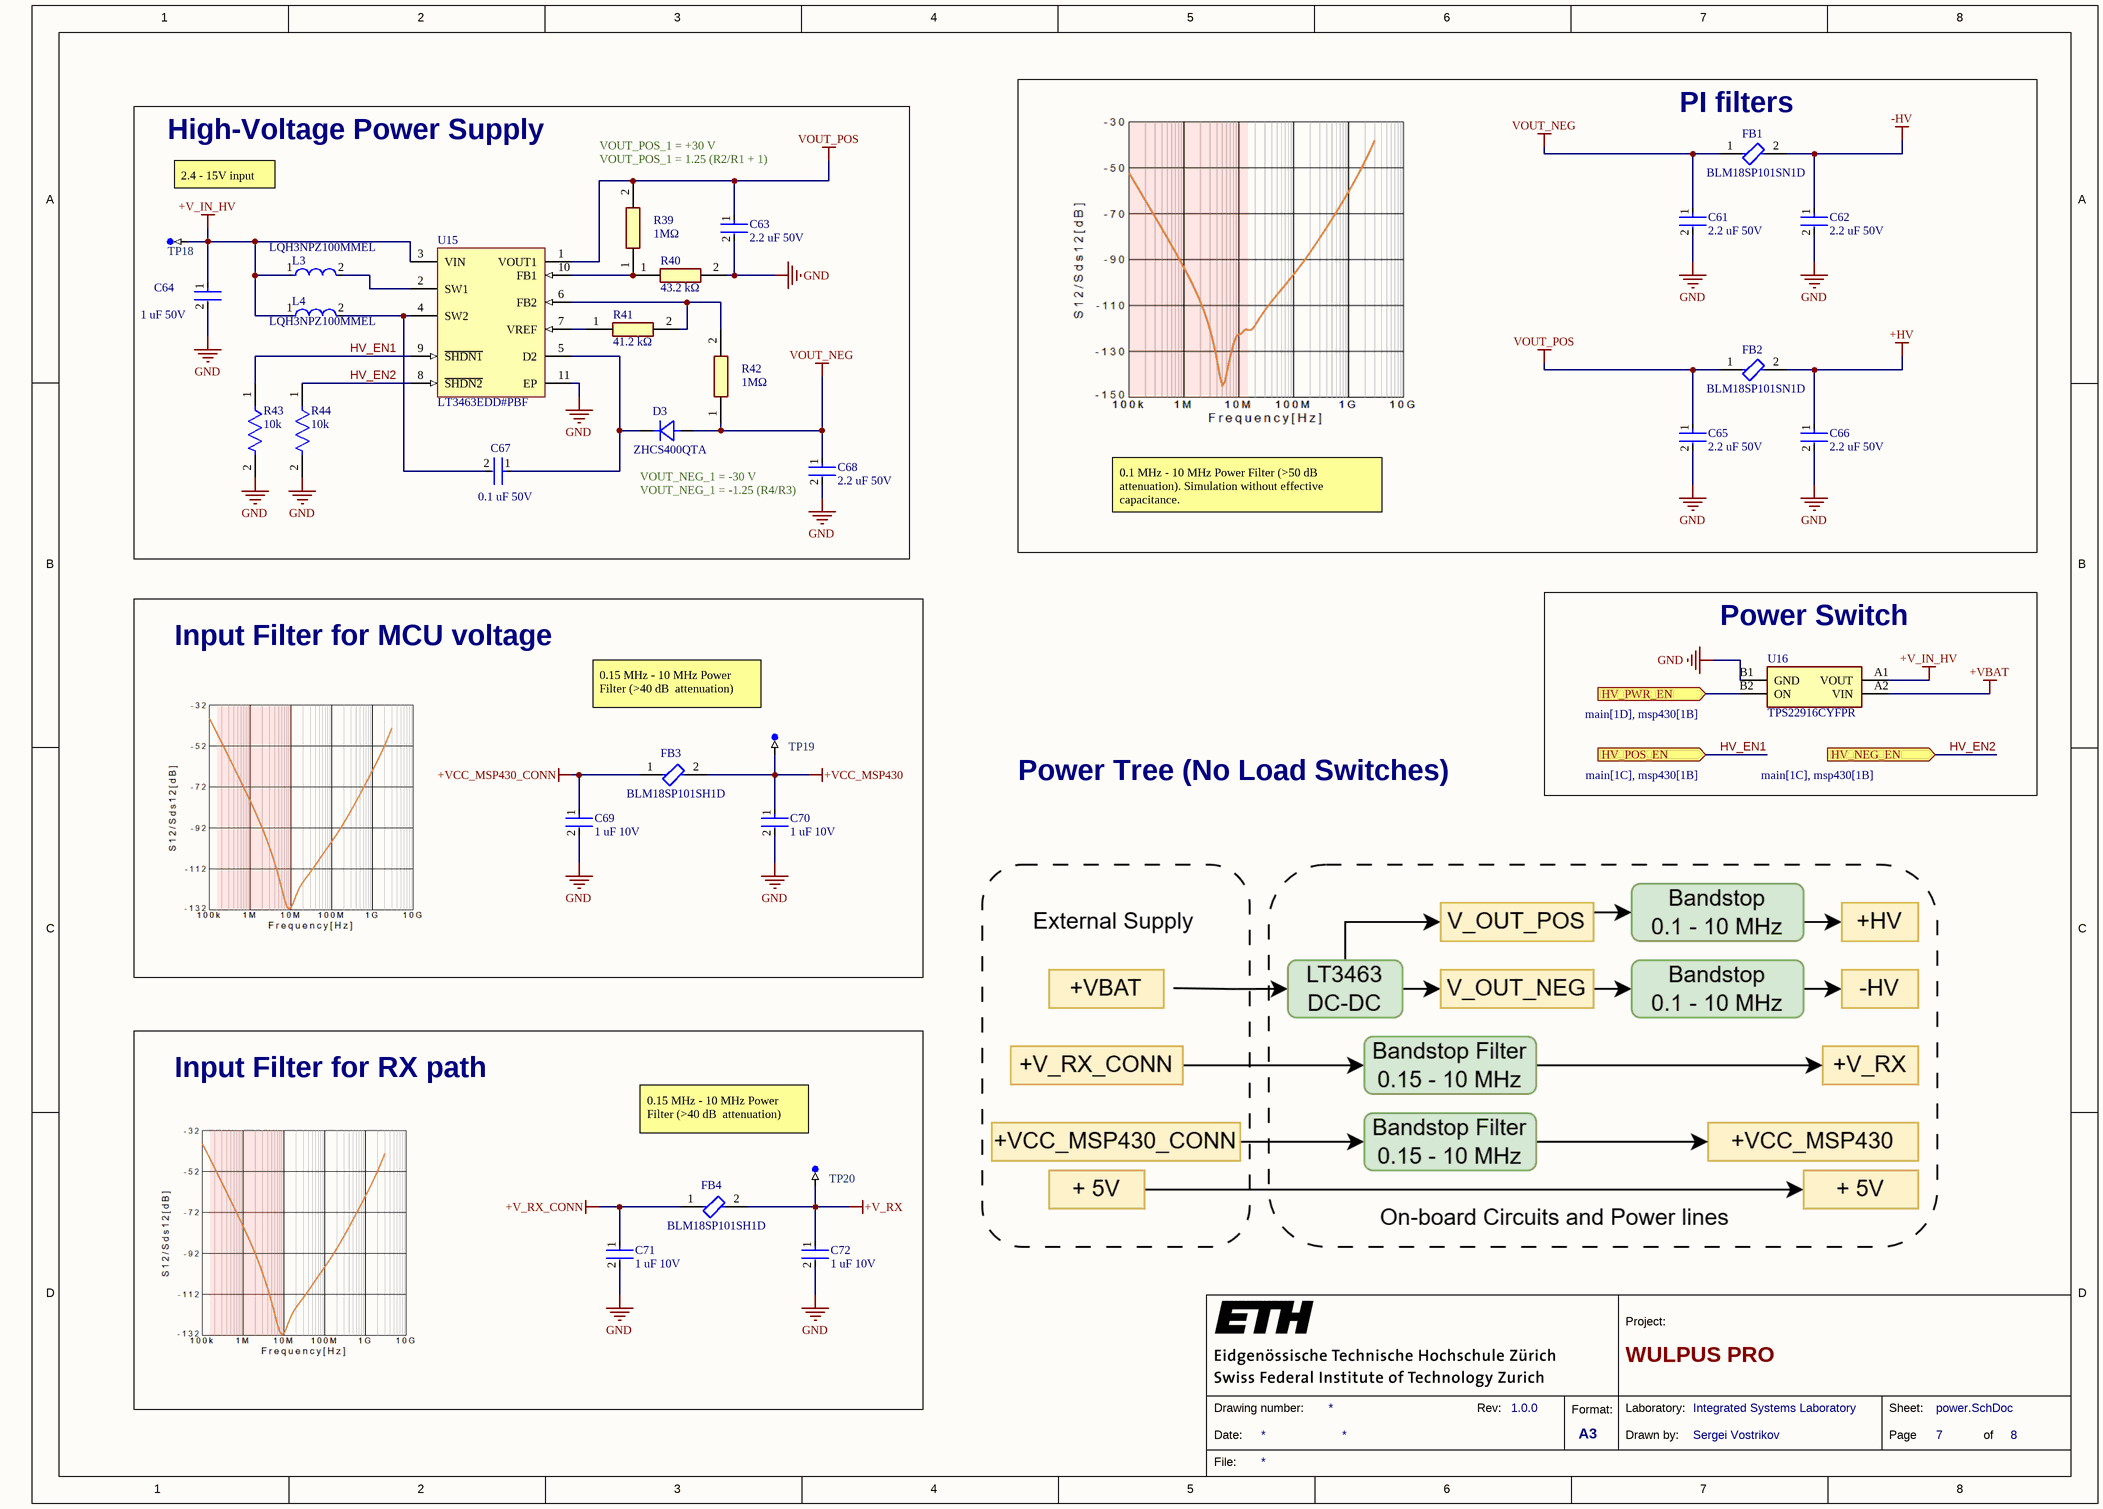
[diagram p7: power.SchDoc]

### Parts
C61  2.2 uF 50V  [FP-GRM188-0_2-IPC_B]
C62  2.2 uF 50V  [FP-GRM188-0_2-IPC_B]
C63  2.2 uF 50V  [FP-GRM188-0_2-IPC_B]
C64  1 uF 50V  [FP-GCM21B-0_15-IPC_C]
C65  2.2 uF 50V  [FP-GRM188-0_2-IPC_B]
C66  2.2 uF 50V  [FP-GRM188-0_2-IPC_B]
C67  0.1 uF 50V  [FP-GRM155-0_05-MFG]
C68  2.2 uF 50V  [FP-GRM188-0_2-IPC_B]
C69  1 uF 10V  [FP-GRM155-0_1-IPC_C]
C70  1 uF 10V  [FP-GRM155-0_1-IPC_C]
C71  1 uF 10V  [FP-GRM155-0_1-IPC_C]
C72  1 uF 10V  [FP-GRM155-0_1-IPC_C]
D3  ZHCS400QTA  [DIODE_SOD323_DIO]
FB1  BLM18SP101SN1D  [FP-BLM18-0_15-t0_8-MFG]
FB2  BLM18SP101SN1D  [FP-BLM18-0_15-t0_8-MFG]
FB3  BLM18SP101SH1D  [FP-BLM18-0_15-t0_8-MFG]
FB4  BLM18SP101SH1D  [FP-BLM18-0_15-t0_8-MFG]
L3  LQH3NPZ100MMEL  [FP-LQH3NPH_ME-MFG]
L4  LQH3NPZ100MMEL  [FP-LQH3NPH_ME-MFG]
R39  1MΩ  [ERJ2RKD1004X]
R40  43.2 kΩ  [ERJ2RKD1004X]
R41  41.2 kΩ  [ERJ2RKD1004X]
R42  1MΩ  [ERJ2RKD1004X]
R43  10k  [FP-CRCW0402-e3-IPC_B]
R44  10k  [FP-CRCW0402-e3-IPC_B]
TP18  TP-SM-C-100  [TP-SM-C-100]  (value not drawn)  (no BOM)
TP19  TP-SM-C-100  [TP-SM-C-100]  (value not drawn)  (no BOM)
TP20  TP-SM-C-100  [TP-SM-C-100]  (value not drawn)  (no BOM)
U15  LT3463EDD#PBF  [LT-DD-10_V]
U16  TPS22916CYFPR  [BGA4C40P2X2_78X78X50]

### Blocks framed on the sheet
High-Voltage Power Supply: C63 C64 C67 C68 D3 L3 L4 R39-R44 TP18 U15
PI filters: C61 C62 C65 C66 FB1 FB2
Input Filter for MCU voltage: C69 C70 FB3 TP19
Power Switch: U16
Input Filter for RX path: C71 C72 FB4 TP20

### Ports
HV_NEG_EN (in, see main[1C], msp430[1B]), HV_POS_EN (in, see main[1C], msp430[1B]), HV_PWR_EN (in, see main[1D], msp430[1B])

### Nets
+HV: C66.1 FB2.2
+V_IN_HV: C64.1 L3.1 L4.1 TP18.1 U15.3(VIN) U16.A1(VOUT)
+V_RX: C72.1 FB4.2 TP20.1
+V_RX_CONN: C71.1 FB4.1
+VBAT: U16.A2(VIN)
+VCC_MSP430: C70.1 FB3.2 TP19.1  [project net DVCC1]
+VCC_MSP430_CONN: C69.1 FB3.1
-HV: C62.1 FB1.2
GND: C61.2 C62.2 C63.2 C64.2 C65.2 C66.2 C68.2 C69.2 C70.2 C71.2 C72.2 R40.2 R43.2 R44.2 U15.11(EP) U16.B1(GND)
VOUT_NEG: C61.1 C68.1 D3.2 FB1.1 R42.1
VOUT_POS: C63.1 C65.1 FB2.1 R39.2 U15.1(VOUT1)
HV_EN1: R43.1 U15.9(~{SHDN1}) ; port HV_POS_EN
HV_EN2: R44.1 U15.8(~{SHDN2}) ; port HV_NEG_EN
HV_PWR_EN: U16.B2(ON) ; port HV_PWR_EN
NetC67_1: C67.1 D3.1 U15.5(D2)
NetC67_2: C67.2 L4.2 U15.4(SW2)
NetL3_2: L3.2 U15.2(SW1)
NetR39_1: R39.1 R40.1 U15.10(FB1)
NetR41_1: R41.1 U15.7(VREF)
NetR41_2: R41.2 R42.2 U15.6(FB2)

### Notes on the sheet
- 2.4 - 15V input
- VOUT_POS_1 = 1.25 (R2/R1 + 1)
- VOUT_POS_1 = +30 V
- (near C68) VOUT_NEG_1 = -1.25 (R4/R3)
- (near D3) VOUT_NEG_1 = -30 V
- 0.1 MHz - 10 MHz Power Filter (>50 dB  attenuation). Simulation without effective capacitance.
- (near TP19) 0.15 MHz - 10 MHz Power Filter (>40 dB  attenuation)
- Power Tree (No Load Switches)
- (near TP20) 0.15 MHz - 10 MHz Power Filter (>40 dB  attenuation)
- 1
- 2
- 3
- 4
- 5
- 6
- 7
- 8
- A
- B
- C
- D
- Project:
- Date:
- Drawing number:
- Rev:
- Format:
- A3
- Drawn by:
- Laboratory:
- Page
- Sheet:
- of
- File:

### Library data of the parts
C61-C63 C65 C66 C68 = CMP-06035-000704-1: GRM188R61H225ME11D; Capacitance: 2.2uF; Dielectric: X5R; Tolerance: 20%; Weight: 0.000222oz; Min Operating Temperature: -55°C; Voltage Rating (DC): 50V; Case Code (Imperial): 0603; Thickness: 0.039inch; Height: 0.8mm; Termination: SMD/SMT; Resistor Type: Ceramic; Case/Package: 0603; Package Quantity: 4000; Length: 0.063inch; Lead Free: Lead Free; Max Operating Temperature: 85°C; Packaging: Tape and Reel; Width: 0.031inch; Voltage Rating: 50V; Mount: Surface Mount; Case Code (Metric): 1608
C64 = CMP-2007-03354-2: GCM21BR71H105KA03L; Dielectric: X7R; Capacitance: 1uF; Tolerance: 10%; Min Operating Temperature: -55°C; Length: 2mm; Package Quantity: 3000; Case Code (Metric): 2012; Max Operating Temperature: 125°C; Termination: SMD/SMT; Thickness: 0.055inch; Ratings: AEC-Q200; Voltage Rating (DC): 50V; Voltage Rating: 50V; Lead Free: Lead Free; Width: 0.049inch; Mount: Surface Mount; Case/Package: 0805; Case Code (Imperial): 0805; Radiation Hardening: No; Height: 1.25mm; Depth: 1.2mm; Packaging: Tape and Reel; Weight: 0.000335oz
C67 = CMP-06035-019038-1: GRM155C71H104KE19D; Dielectric: X7S; Tolerance: 10%; Capacitance: 100nF; Voltage Rating (DC): 50V; Width: 500um; Thickness: 500um; Length: 1mm
C69-C72 = CMP-06035-028020-1: GRM155Z71A105KE01D
D3 = ZHCS400QTA: Diode Schottky 40V 1A Automotive 2-Pin SOD-323 T/R; Manufacturer: Diodes; Supplier 1: Farnell; RoHS: Yes; Category: Rectifier Diodes; Stock 1: 385; Pricing 1: 5=0.87300, 10=0.73400, 100=0.49400, 500=0.38800 (CHF); Mount: Surface Mount; Packaging: Tape and Reel; Average Rectified Current: 1A; Max Reverse Voltage (DC): 40V; RoHS Compliant: Yes; ComponentLink1URL: http://www.mouser.com/ds/2/115/ZHCS400Q-959646.pdf?src-supplier=Mouser; ComponentLink1Description: http://www.mouser.com/ds/2/115/ZHCS400Q-959646.pdf?src-supplier=Mouser; Supplier Part Number 1: 3127490; Manufacturer Part Number: ZHCS400QTA
FB1 FB2 = CMP-00260-111572291-1: BLM18SP101SN1D Ferrite Bead, 100 Ohm, 3.7A, 0603 Rohs Compliant: Yes; Test Frequency: 100MHz; Tolerance: 25%; Series Resistance: 22mΩ; NexarPartId: 111572291; Lifecycle Status: Production; Core Material: Ferrite; Height: 950µm; Min Operating Temperature: -55°C; RMS Current (Irms): 3.7A; Resistance: 22mΩ; Max Operating Temperature: 125°C; Case/Package: 0603
FB3 FB4 = CMP-00260-111572290-1: BLM18SP101SH1D Ferrite Beads Multi-Layer 100Ohm 25% 100MHz 3.7A 0.022Ohm DCR 0603 Automotive T/R; Series Resistance: 22mΩ; Min Operating Temperature: -55°C; Test Frequency: 100MHz; Height: 950µm; NexarPartId: 111572290; Tolerance: 25%; Schedule B: 8504500000, 8504500000; Resistance: 22mΩ; Lifecycle Status: Production; Case/Package: 0603; Max Operating Temperature: 125°C; Core Material: Ferrite; RMS Current (Irms): 3.7A
L3 L4 = CMP-06042-007129-1: Wire Wound Ferrite Inductor for Power Lines For Automotive 10μH ±20% 0.228Ω 1280mA 1212; Self Resonant Frequency: 20MHz; Inductance: 10uH; Test Frequency: 1MHz; Shielding: Shielded; Saturation Current: 810mA; DC Resistance (DCR): 228mR; Current Rating: 1.28A; Case Code (Imperial): 1212; Case Code (Metric): 3030; Core Material: Ferrite; Resistor Type: Wirewound; Mount: Surface Mount; Ratings: AEC-Q200; Packaging: Cut Tape; Max Operating Temperature: 85°C; Tolerance: 20%; Min Operating Temperature: -40°C; Case/Package: 1212
R39 R42 = ERJ-2RKF1004X: Manufacturer_Name: Panasonic; Datasheet Link: https://industrial.panasonic.com/cdbs/www-data/pdf/RDA0000/AOA0000C86.pdf; Height: 0.4mm; Manufacturer_Part_Number: ERJ-2RKF1004X; Mouser Part Number: 667-ERJ-2RKF1004X; Mouser Price/Stock: https://www.mouser.co.uk/ProductDetail/Panasonic/ERJ-2RKF1004X?qs=H7k1u0Mp9JTG%252BclS6LVdqw%3D%3D; Arrow Part Number: ERJ-2RKF1004X; Arrow Price/Stock: https://www.arrow.com/en/products/erj-2rkf1004x/panasonic?region=nac
R40 = ERJ-2RKF4322X: Manufacturer_Name: Panasonic; Datasheet Link: https://industrial.panasonic.com/cdbs/www-data/pdf/RDA0000/AOA0000C86.pdf; Height: 0.4mm; Manufacturer_Part_Number: ERJ-2RKF4322X; Mouser Part Number: 667-ERJ-2RKF4322X; Mouser Price/Stock: http://www.mouser.com/Search/ProductDetail.aspx?qs=YMBIwoNQYdULE5GECeB%2fdA%3d%3d
R41 = ERJ-2RKF4122X: Manufacturer_Name: Panasonic; Datasheet Link: https://industrial.panasonic.com/cdbs/www-data/pdf/RDA0000/AOA0000C86.pdf; Height: 0.4mm; Manufacturer_Part_Number: ERJ-2RKF4122X; Mouser Part Number: 667-ERJ-2RKF4122X; Mouser Price/Stock: https://www.mouser.co.uk/ProductDetail/Panasonic/ERJ-2RKF4122X?qs=YMBIwoNQYdUCaGOKDy4kUA%3D%3D; Arrow Part Number: ERJ-2RKF4122X; Arrow Price/Stock: https://www.arrow.com/en/products/erj-2rkf4122x/panasonic?utm_currency=USD&region=nac
R43 R44 = CMP-2002-08136-3: CRCW040210K0JNED; Temperature Coefficient: 200ppm/°C; Voltage Rating: 50V; Power Rating: 63mW; Resistance: 10kR; Tolerance: 5%; Military Standard: Not; Packaging: Tape and Reel; Case Code (Imperial): 0402; Min Operating Temperature: -55°C; Case Code (Metric): 1005; Case/Package: 0402; Termination: SMD/SMT; Composition: Thick Film; Depth: 0.5mm; Number of Terminations: 2; Contact Plating: Tin; Height: 0.016inch; Width: 0.5mm; Max Operating Temperature: 155°C; Features: Automotive AEC-Q200; Length: 1mm; Radiation Hardening: No; Max Power Dissipation: 63mW; Mount: Surface Mount; Package Quantity: 1; Weight: 2.3E-05oz
TP18-TP20 = CMP-0484-00002-1: Test Point, Surface Mount, Circular, Pad Diameter 1 mm
U15 = CMP-0478-00030-1: Dual Micropower DC/DC Converters with Schottky Diodes, 2.4 to 15 V Vin, 10-pin SON (DD-10), -40 to 85 degC, Pb-Free; PartNumber: LT3463AEDD#PBF; Manufacturer: Linear Technology; Vin Max(V): 15; Number of Outputs: 2; Vin Min(V): 2.4; ComponentLink3URL: http://cds.linear.com/docs/en/packaging/DFN_10_05-08-1699.pdf; ComponentLink2URL: http://cds.linear.com/docs/en/datasheet/3463f.pdf; PackageReference: DD-10; PackageVersion: Rev. C, 06/2010; ComponentLink1URL: http://www.linear.com/; RoHS: TRUE; ComponentLink3Description: Package Specification; Mounting Technology: Surface Mount; Code_JEDEC: MO-229; ComponentLink2Description: Datasheet; PackageDescription: 10-Pin Plastic DFN, Body 3 x 3 mm, Pitch 0.5 mm; ComponentLink1Description: Manufacturer URL
U16 = TPS22916CYFPR: TPS22916 5.5-V, 2-A Ultra-Low Leakage Load Switch; Manufacturer_Name: Texas Instruments; Geometry.Height: 0.5mm; Manufacturer_Part_Number: TPS22916CYFPR; Arrow Part Number: TPS22916CYFPR; Arrow Price/Stock: https://www.arrow.com/en/products/tps22916cyfpr/texas-instruments?utm_currency=USD&region=nac; Datasheet Link: http://www.ti.com/lit/gpn/tps22916

## Nets that join several sheets
+5V: hv_mux_tr_sw (C40.2 U12.A2), host_connector (J12.9 X6.2)
+HV: tx_path (C26.1 U9.6), hv_mux_tr_sw (J8.1), power (C66.1 FB2.2)
+V_RX: rx_path (16 pins), rx_path_lp_filter (C28.1 C29.2 U10.6), power (C72.1 FB4.2 TP20.1)
+V_RX_CONN: host_connector (J12.11 X7.2), power (C71.1 FB4.1)
+VBAT: host_connector (J12.1 J12.2 X5.2), power (U16.A2)
+VCC_MSP430_CONN: host_connector (J12.10 X8.2), power (C69.1 FB3.1)
-HV: hv_mux_tr_sw (J8.3 R24.1), power (C62.1 FB1.2)
DVCC1: hv_mux_tr_sw (C32.1 C33.2 U11.18), msp430 (10 pins), host_connector (8 pins), power (C70.1 FB3.2 TP19.1)
GND: main (TP8.1 TP9.1), rx_path (30 pins), rx_path_lp_filter (5 pins), tx_path (9 pins), hv_mux_tr_sw (39 pins), msp430 (38 pins), host_connector (22 pins), power (16 pins)
BSL_UART_RX: msp430 (U14.22), host_connector (X1.3)
BSL_UART_TX: msp430 (U14.21), host_connector (X1.4)
CH0_OUT: tx_path (R13.1), msp430 (U14.59)
DATA_READY: msp430 (U14.42), host_connector (U18.11 X4.2)
ENV_DET_EN: rx_path (5 pins), msp430 (U14.25)
FILTER_SHDN_N: rx_path_lp_filter (R22.1 TP11.1 U10.5), msp430 (U14.27)
HOST_LINK_RDY: msp430 (U14.41), host_connector (U18.12 X4.3)
HOST_SPARE: msp430 (U14.43), host_connector (U18.9 X4.1)
HOST_SPI_CLK: msp430 (U14.36), host_connector (U17.11 X3.3)
HOST_SPI_CS: msp430 (U14.37), host_connector (U17.9 X3.4)
HOST_SPI_MISO: msp430 (U14.35), host_connector (U17.12 X3.1)
HOST_SPI_MOSI: msp430 (U14.34), host_connector (U17.10 X3.2)
HV_EN1: msp430 (U14.50), power (R43.1 U15.9)
HV_EN2: msp430 (U14.51), power (R44.1 U15.8)
HV_MUX_CLR: hv_mux_tr_sw (U11.22), msp430 (U14.31)
HV_MUX_LE: hv_mux_tr_sw (U11.21), msp430 (U14.46)
HV_MUX_PWR_EN: hv_mux_tr_sw (TP12.1 U12.B2), msp430 (U14.44)
HV_PWR_EN: msp430 (U14.52), power (U16.B2)
JTAG_RESET_N: msp430 (C56.1 PJ1.2 R37.2 U14.12), host_connector (J12.50 X1.5)
JTAG_TCK: msp430 (PJ1.6 U14.16), host_connector (J12.49)
JTAG_TDI: msp430 (PJ1.3 U14.14), host_connector (J12.39)
JTAG_TDO: msp430 (PJ1.4 U14.13), host_connector (J12.38)
JTAG_TEST: msp430 (PJ1.1 U14.11), host_connector (R45.1)
JTAG_TMS: msp430 (PJ1.5 U14.15), host_connector (J12.40)
NetC6_1: rx_path (C6.1 R6.1), hv_mux_tr_sw (D1.1 D1.2 R28.2 U13.3)
NetC25_2: tx_path (C25.2 R15.2), hv_mux_tr_sw (C41.2 R26.1 R30.2)
NetC27_2: rx_path_lp_filter (C27.2 R21.2), msp430 (C43.1)
NetTP10_1: rx_path (U4.C2), rx_path_lp_filter (TP10.1 U10.3)
PREAMP_EN: rx_path (R12.1 U2.5), msp430 (U14.20)
PREAMP_PWR_EN: rx_path (TP5.1 U8.B2), msp430 (U14.26)
PULS_HIZ_EN: tx_path (Q1.1 R16.2), msp430 (U14.47)
RX_SPI_CLK: rx_path (U3.5), hv_mux_tr_sw (U11.20), msp430 (U14.38)
RX_SPI_MISO: hv_mux_tr_sw (U11.23), msp430 (U14.40)
RX_SPI_MOSI: rx_path (U3.2), hv_mux_tr_sw (U11.19), msp430 (U14.39)
VGA_GAIN_CS: rx_path (U3.3), msp430 (U14.4)
VGA_GAIN_RC_EN: rx_path (R5.1), msp430 (U14.3)
VGA_GAIN_RC_SINK: rx_path (R1.1), msp430 (U14.2)
VGA_PWR_EN: rx_path (TP4.1 U6.B2), msp430 (U14.19)

## Assembly variants
polycmuts_tia_direct_bias: not fitted C6 C39 C41 C? R15 R17 R18 R26 R46 R? R? R? R? R? X1
pzt_hia_no_bias: not fitted C12 C? R6 R7 R15 R17 R18 R25 R30 R46 R? R? R? R? R?